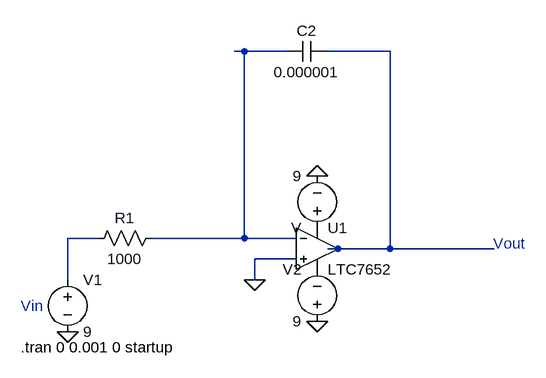
[diagram p0: schematic Draft6.asc]
Draft6.asc, the LTspice schematic file:
Version 4
SHEET 1 880 680
WIRE 64 -128 48 -128
WIRE 128 -128 64 -128
WIRE 288 -128 192 -128
WIRE -160 160 -208 160
WIRE 64 160 64 -128
WIRE 64 160 -80 160
WIRE 144 160 64 160
WIRE 208 176 192 176
WIRE 288 176 288 -128
WIRE 288 176 208 176
WIRE 448 176 288 176
WIRE 144 192 80 192
WIRE -208 224 -208 160
WIRE 80 224 80 192
FLAG -208 304 0
FLAG 176 288 0
FLAG 176 64 0
FLAG 80 224 0
SYMBOL OpAmps\\LTC7652 176 112 R0
SYMATTR InstName U1
SYMBOL res -64 144 R90
WINDOW 0 0 56 VBottom 2
WINDOW 3 32 56 VTop 2
SYMATTR InstName R1
SYMATTR Value 1000
SYMBOL voltage -208 208 R0
SYMATTR InstName V1
SYMATTR Value 9
SYMBOL voltage 176 304 R180
WINDOW 0 24 96 Left 2
WINDOW 3 24 16 Left 2
SYMATTR InstName V2
SYMATTR Value 9
SYMBOL voltage 176 160 R180
WINDOW 0 24 96 Left 2
WINDOW 3 24 16 Left 2
SYMATTR InstName 9
SYMBOL cap 192 -144 R90
WINDOW 0 0 32 VBottom 2
WINDOW 3 32 32 VTop 2
SYMATTR InstName C2
SYMATTR Value 0.000001
TEXT 496 168 Right 2 ;Vout
TEXT -280 264 Left 2 ;Vin
TEXT -280 328 Left 2 !.tran 0 0.001 0 startup

The netlist it stands for:
* Draft6.asc
XU1 0 N001 P001 P002 N002 LTC1052  ; LTC7652, pins In+ In- V+ V- OUT
R1 N001 N003 1000
V1 N003 0 9
V2 0 P002 9
V§9 P001 0 V
C2 N002 N001 0.000001
* Vout
* Vin
.tran 0 0.001 0 startup
.backanno
.end